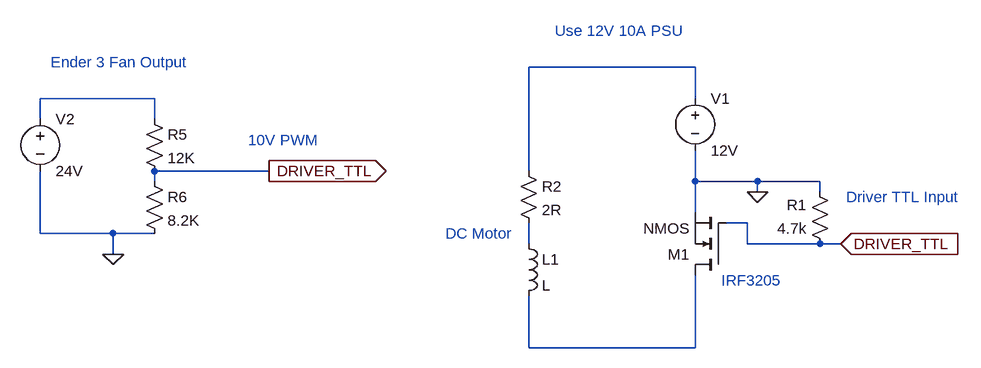
[diagram p0: schematic schematics.asc]
schematics.asc, the LTspice schematic file:
Version 4
SHEET 1 1132 680
WIRE 336 -400 80 -400
WIRE -496 -352 -672 -352
WIRE 336 -352 336 -400
WIRE -672 -320 -672 -352
WIRE -496 -320 -496 -352
WIRE -320 -240 -496 -240
WIRE 80 -240 80 -400
WIRE -496 -224 -496 -240
WIRE 336 -224 336 -272
WIRE 432 -224 336 -224
WIRE 528 -224 432 -224
WIRE 432 -208 432 -224
WIRE 528 -208 528 -224
WIRE 336 -176 336 -224
WIRE 416 -160 384 -160
WIRE -672 -144 -672 -240
WIRE -560 -144 -672 -144
WIRE -496 -144 -560 -144
WIRE 80 -128 80 -160
WIRE 416 -128 416 -160
WIRE 528 -128 416 -128
WIRE 560 -128 528 -128
WIRE -560 -112 -560 -144
WIRE 80 32 80 -48
WIRE 336 32 336 -80
WIRE 336 32 80 32
FLAG -560 -112 0
FLAG -320 -240 DRIVER_TTL
IOPIN -320 -240 Out
FLAG 560 -128 DRIVER_TTL
IOPIN 560 -128 In
FLAG 432 -208 0
SYMBOL res 64 -256 R0
SYMATTR InstName R2
SYMATTR Value 2R
SYMATTR SpiceLine pwr=1
SYMBOL voltage -672 -336 R0
WINDOW 123 0 0 Left 0
WINDOW 39 0 0 Left 0
SYMATTR InstName V2
SYMATTR Value 24V
SYMBOL res -512 -336 R0
SYMATTR InstName R5
SYMATTR Value 12K
SYMBOL res -512 -240 R0
SYMATTR InstName R6
SYMATTR Value 8.2K
SYMBOL res 544 -112 R180
WINDOW 0 36 76 Left 2
WINDOW 3 36 40 Left 2
SYMATTR InstName R1
SYMATTR Value 4.7k
SYMBOL nmos 384 -80 R180
SYMATTR InstName M1
SYMBOL ind 64 -144 R0
SYMATTR InstName L1
SYMBOL voltage 336 -368 R0
WINDOW 123 0 0 Left 0
WINDOW 39 0 0 Left 0
SYMATTR InstName V1
SYMATTR Value 12V
TEXT -656 -408 Left 2 ;Ender 3 Fan Output
TEXT -352 -288 Left 2 ;10V PWM
TEXT 120 -456 Left 2 ;Use 12V 10A PSU
TEXT 744 -200 Right 2 ;Driver TTL Input
TEXT 376 -72 Left 2 ;IRF3205
TEXT -48 -144 Left 2 ;DC Motor

The netlist it stands for:
* schematics.asc
R2 N001 N003 2R pwr=1
V2 N002 0 24V
R5 N002 DRIVER_TTL 12K
R6 DRIVER_TTL 0 8.2K
R1 DRIVER_TTL 0 4.7k
M1 N004 DRIVER_TTL 0 0 NMOS
L1 N003 N004 L
V1 N001 0 12V
.model NMOS NMOS
.model PMOS PMOS
.lib standard.mos
* Ender 3 Fan Output
* 10V PWM
* Use 12V 10A PSU
* Driver TTL Input
* IRF3205
* DC Motor
.backanno
.end